# EasyEDA Pro project 8CH_ADC_CAPTURE_CARD.epro, schematic 8CH_ADC_CARD_V3.X

## Sheets
1 MCU: Create Date: 2025-01-20; Page Name: MCU; Project Name: 8CH_ADC_CAPTURE_CARD; Schematic Name: 8CH_ADC_CARD_V2.X; Update Date: 2025-01-22; Company: 嘉立创EDA; Page Size: A4; Version: V1.0
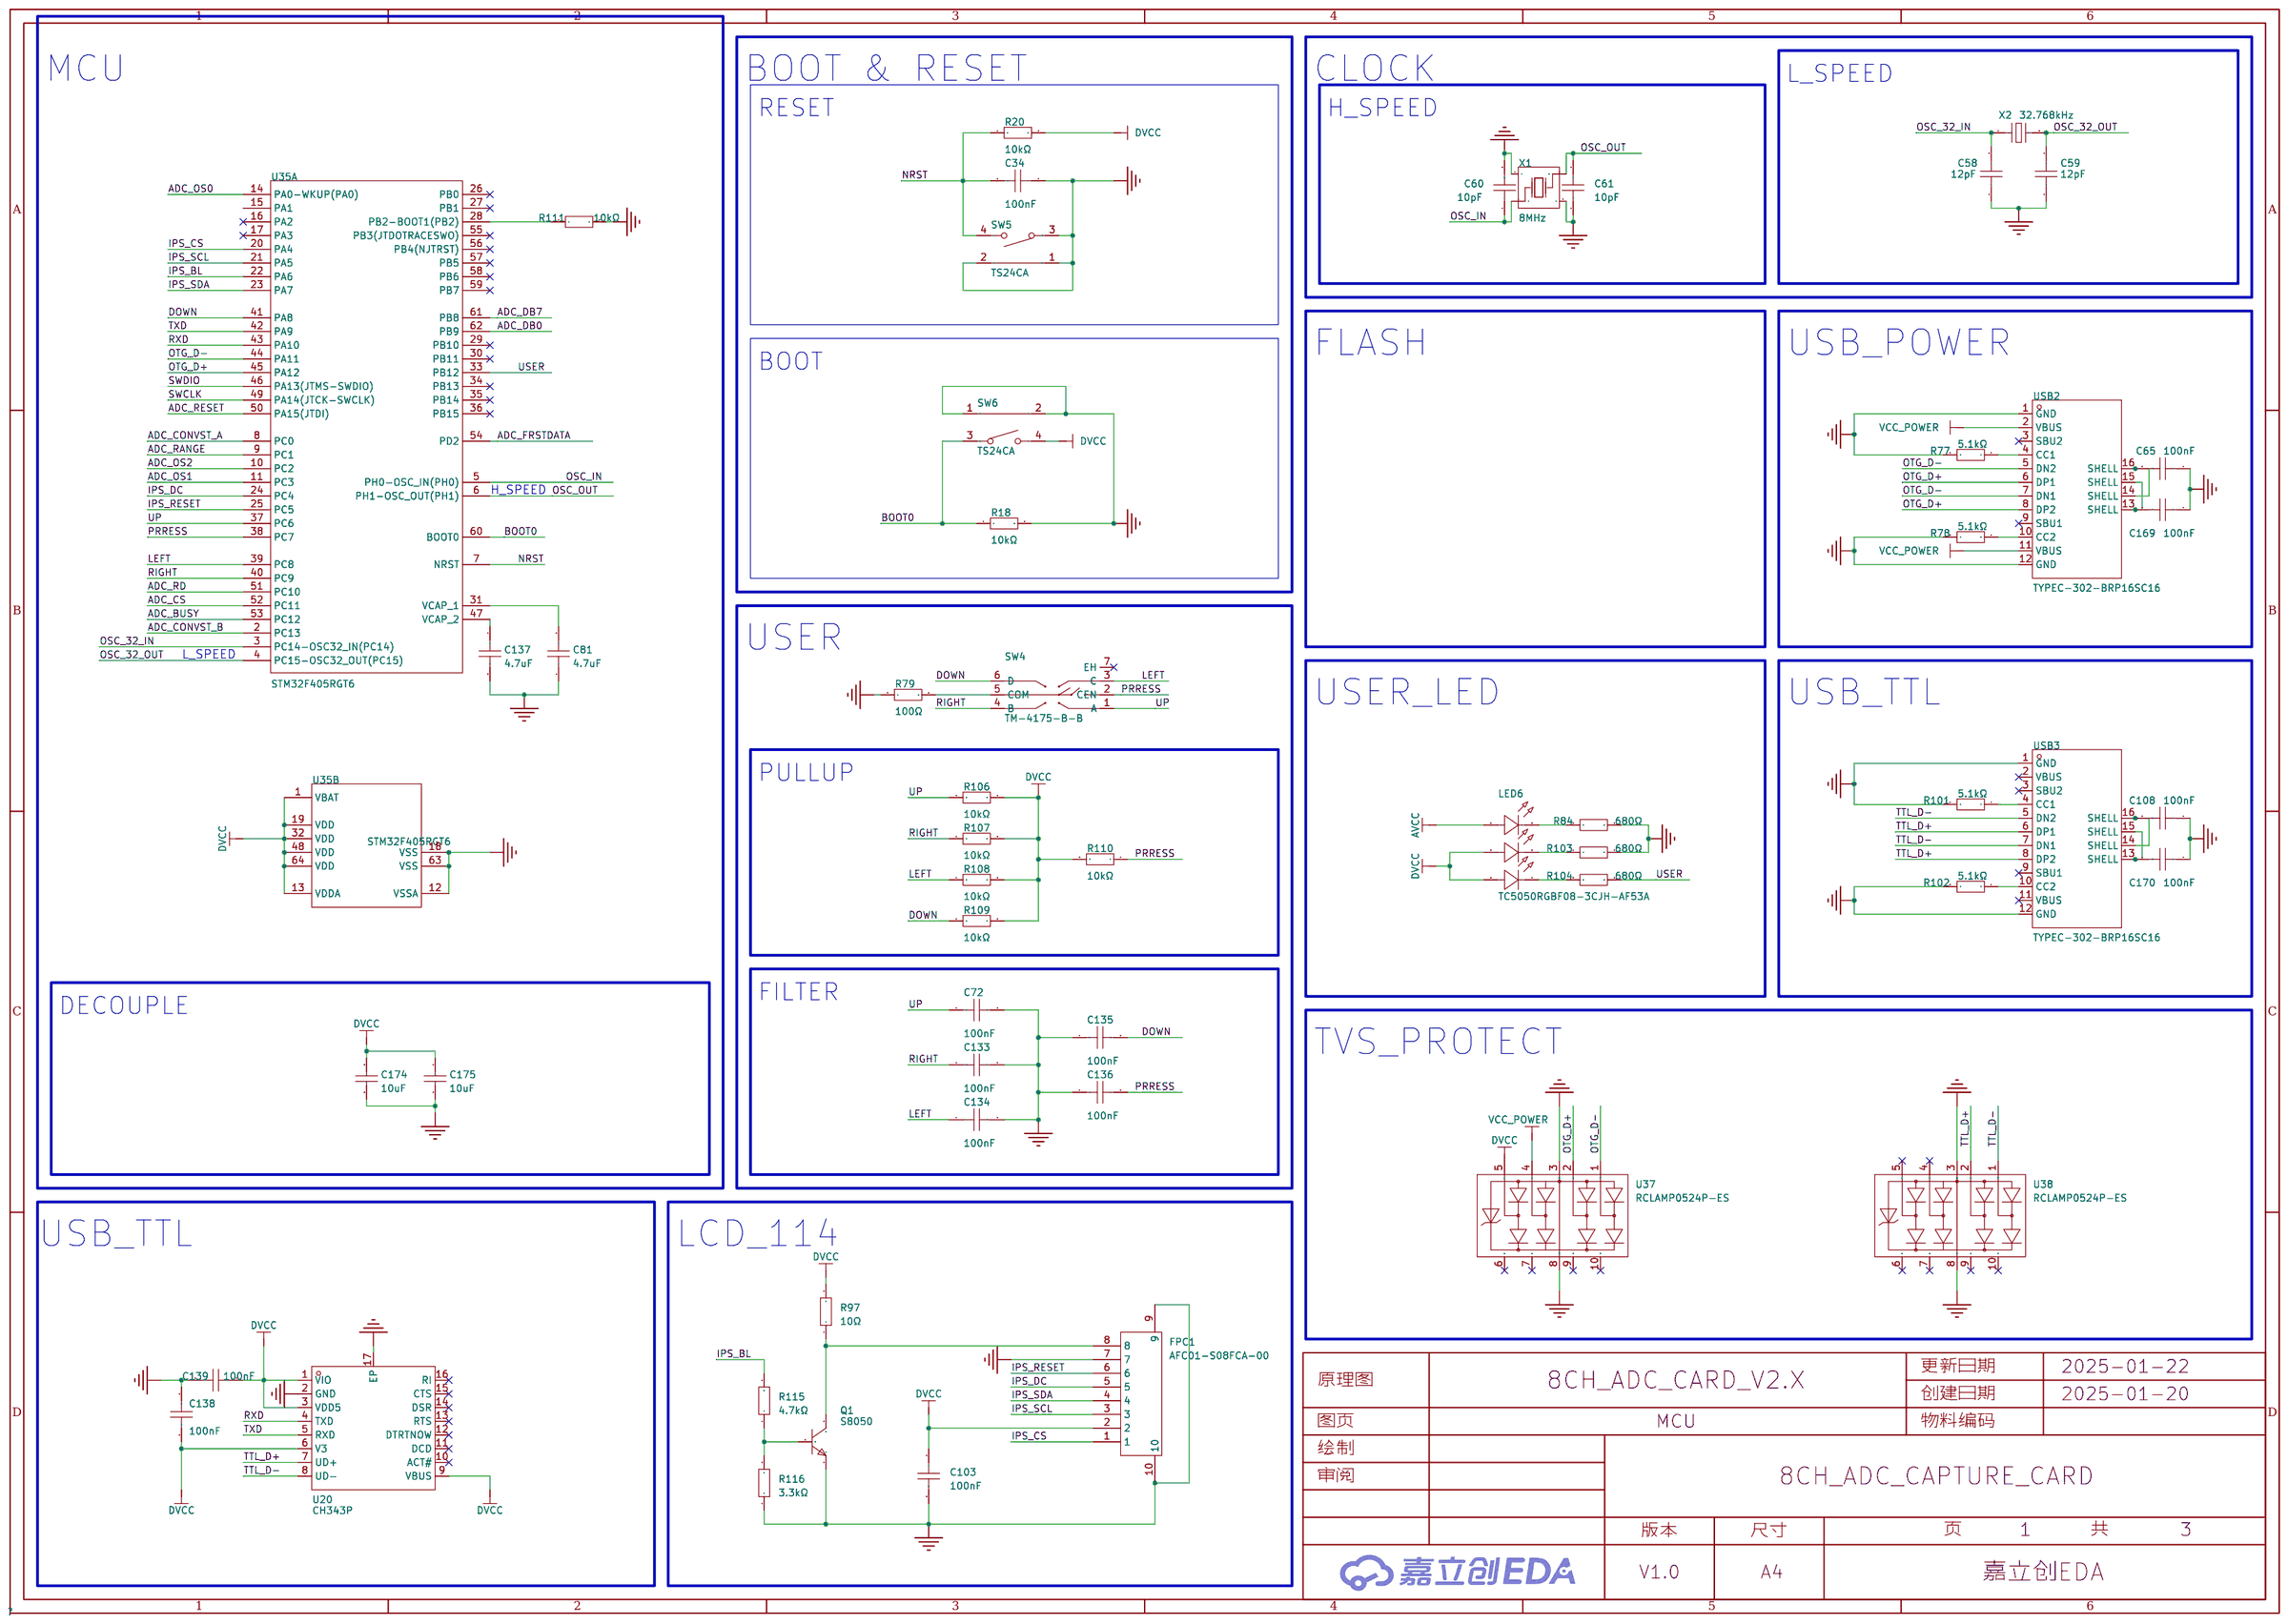
[diagram p6: MCU]
2 ADC: Page Name: ADC; Update Date: 2025-01-20
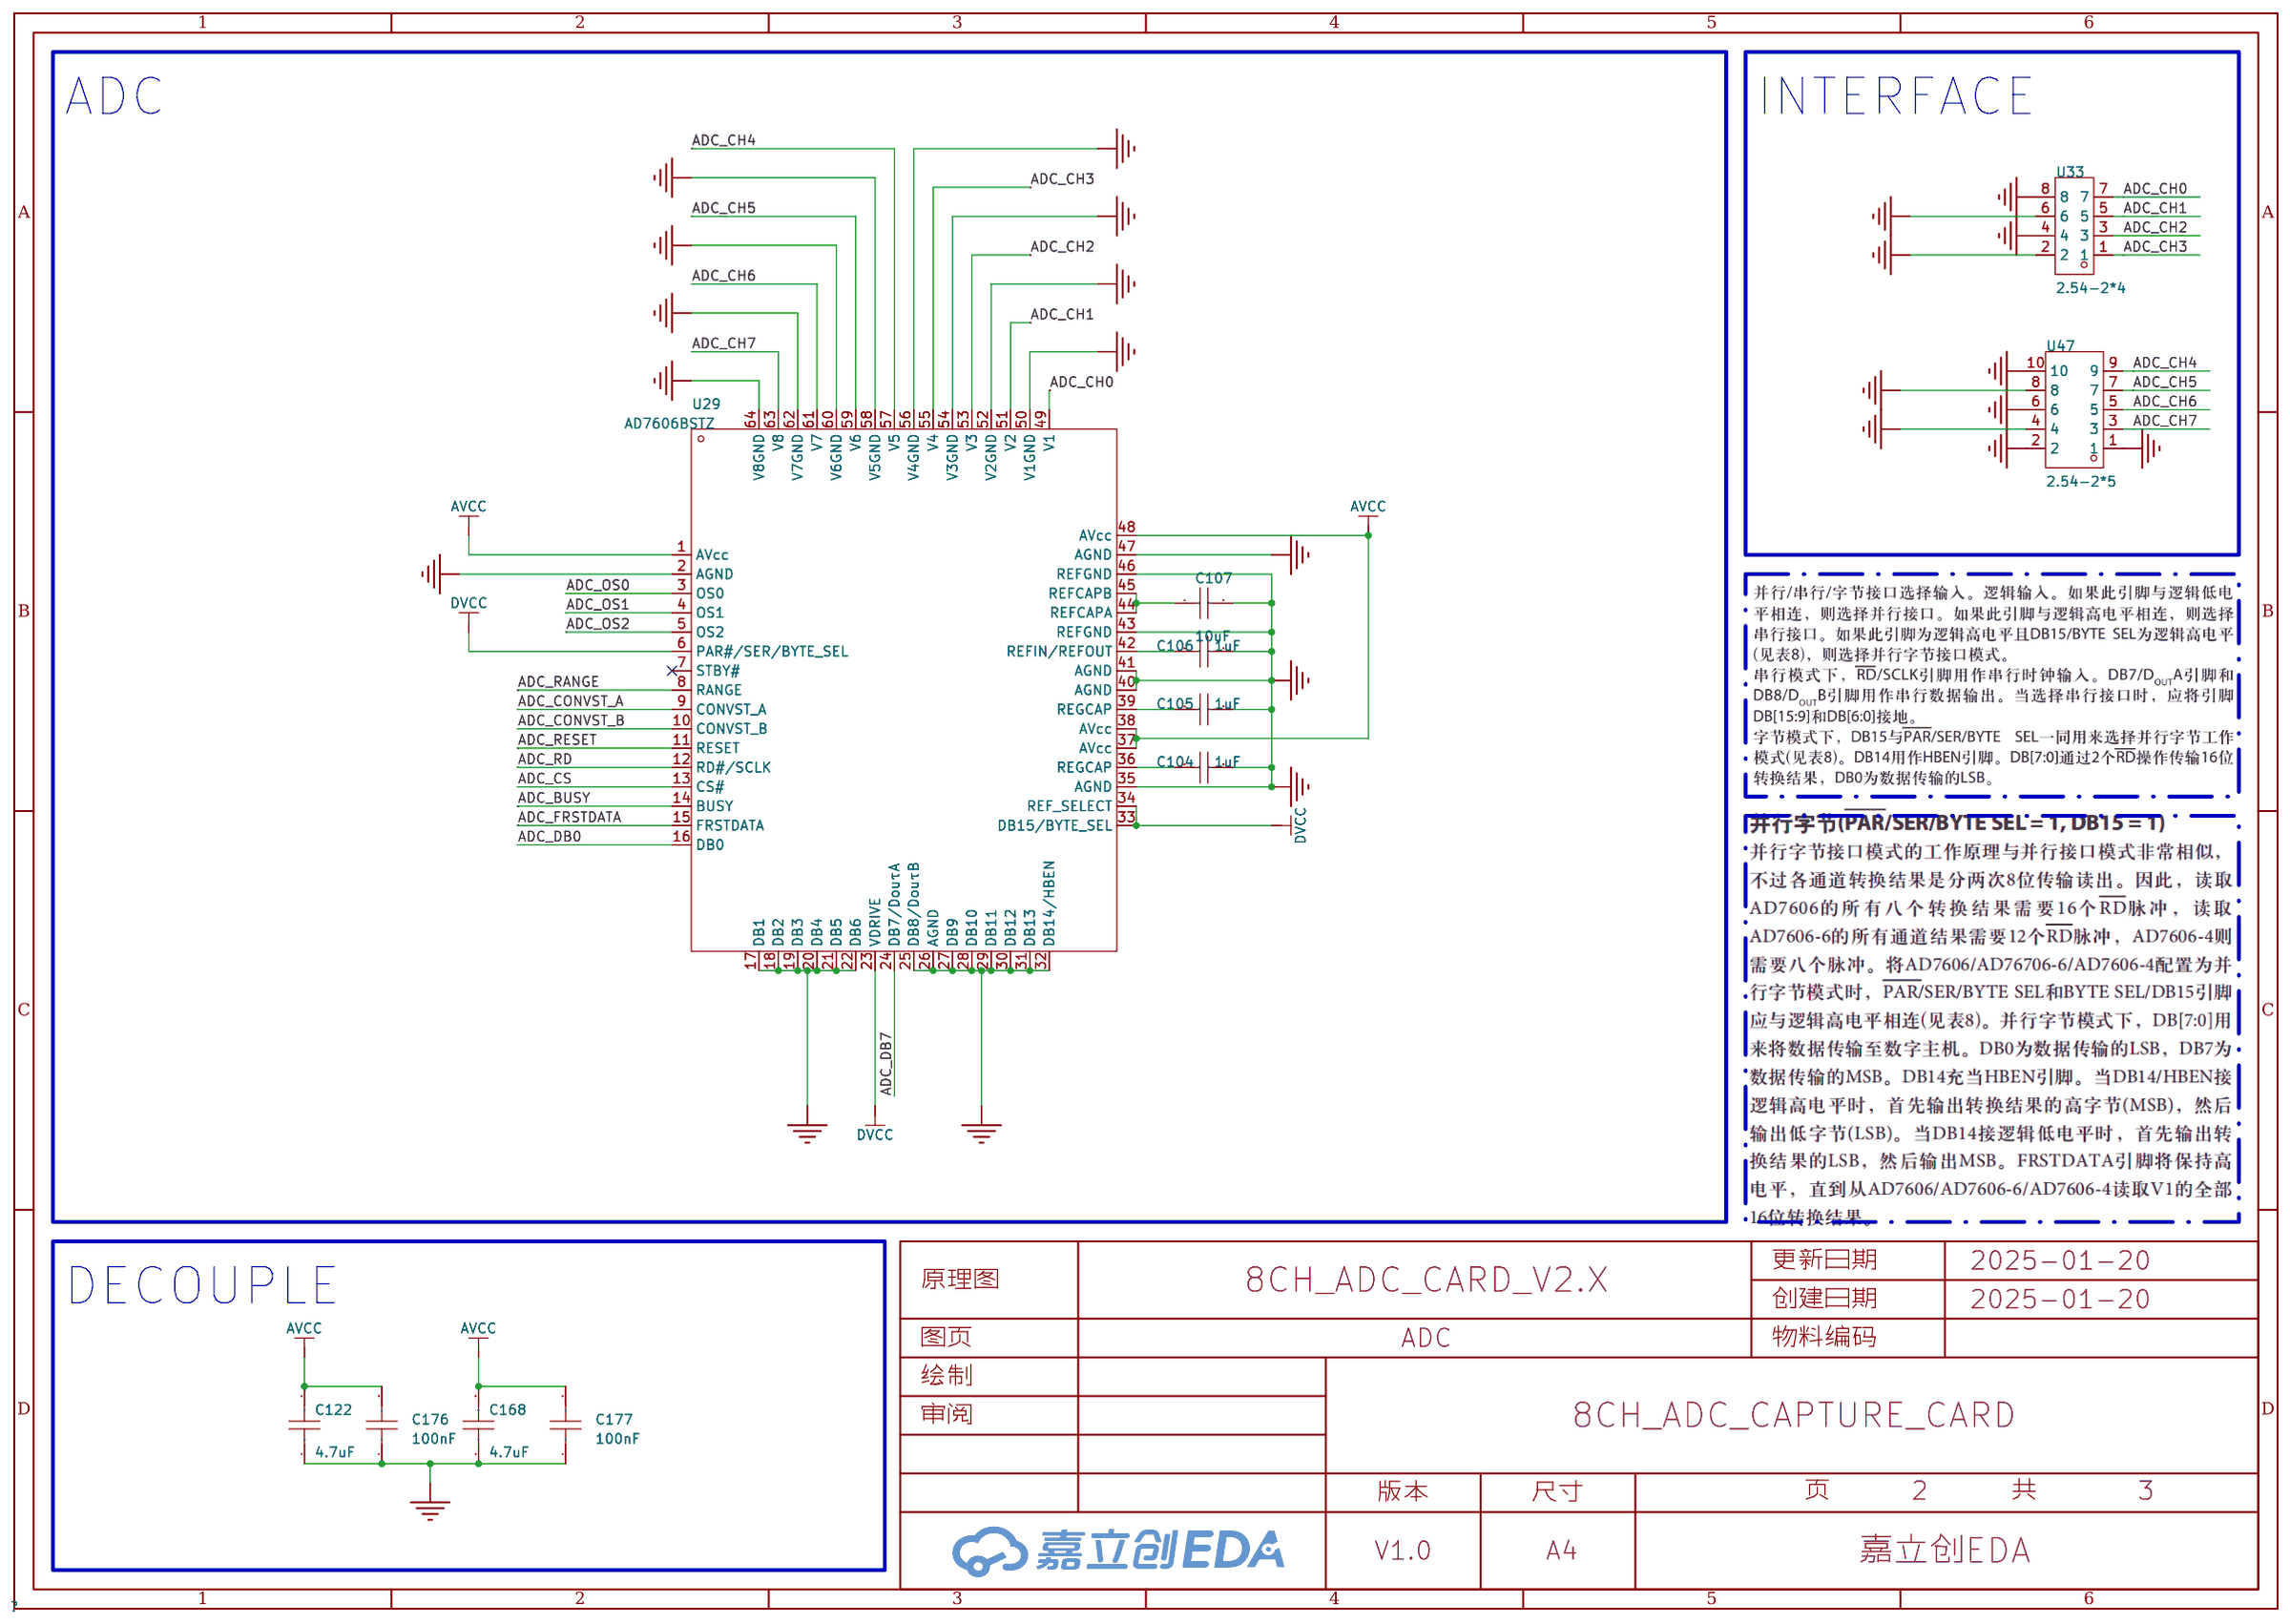
[diagram p7: ADC]
3 POWER: Page Name: POWER; Schematic Name: 8CH_ADC_CARD_V2.0; Update Date: 2025-01-20
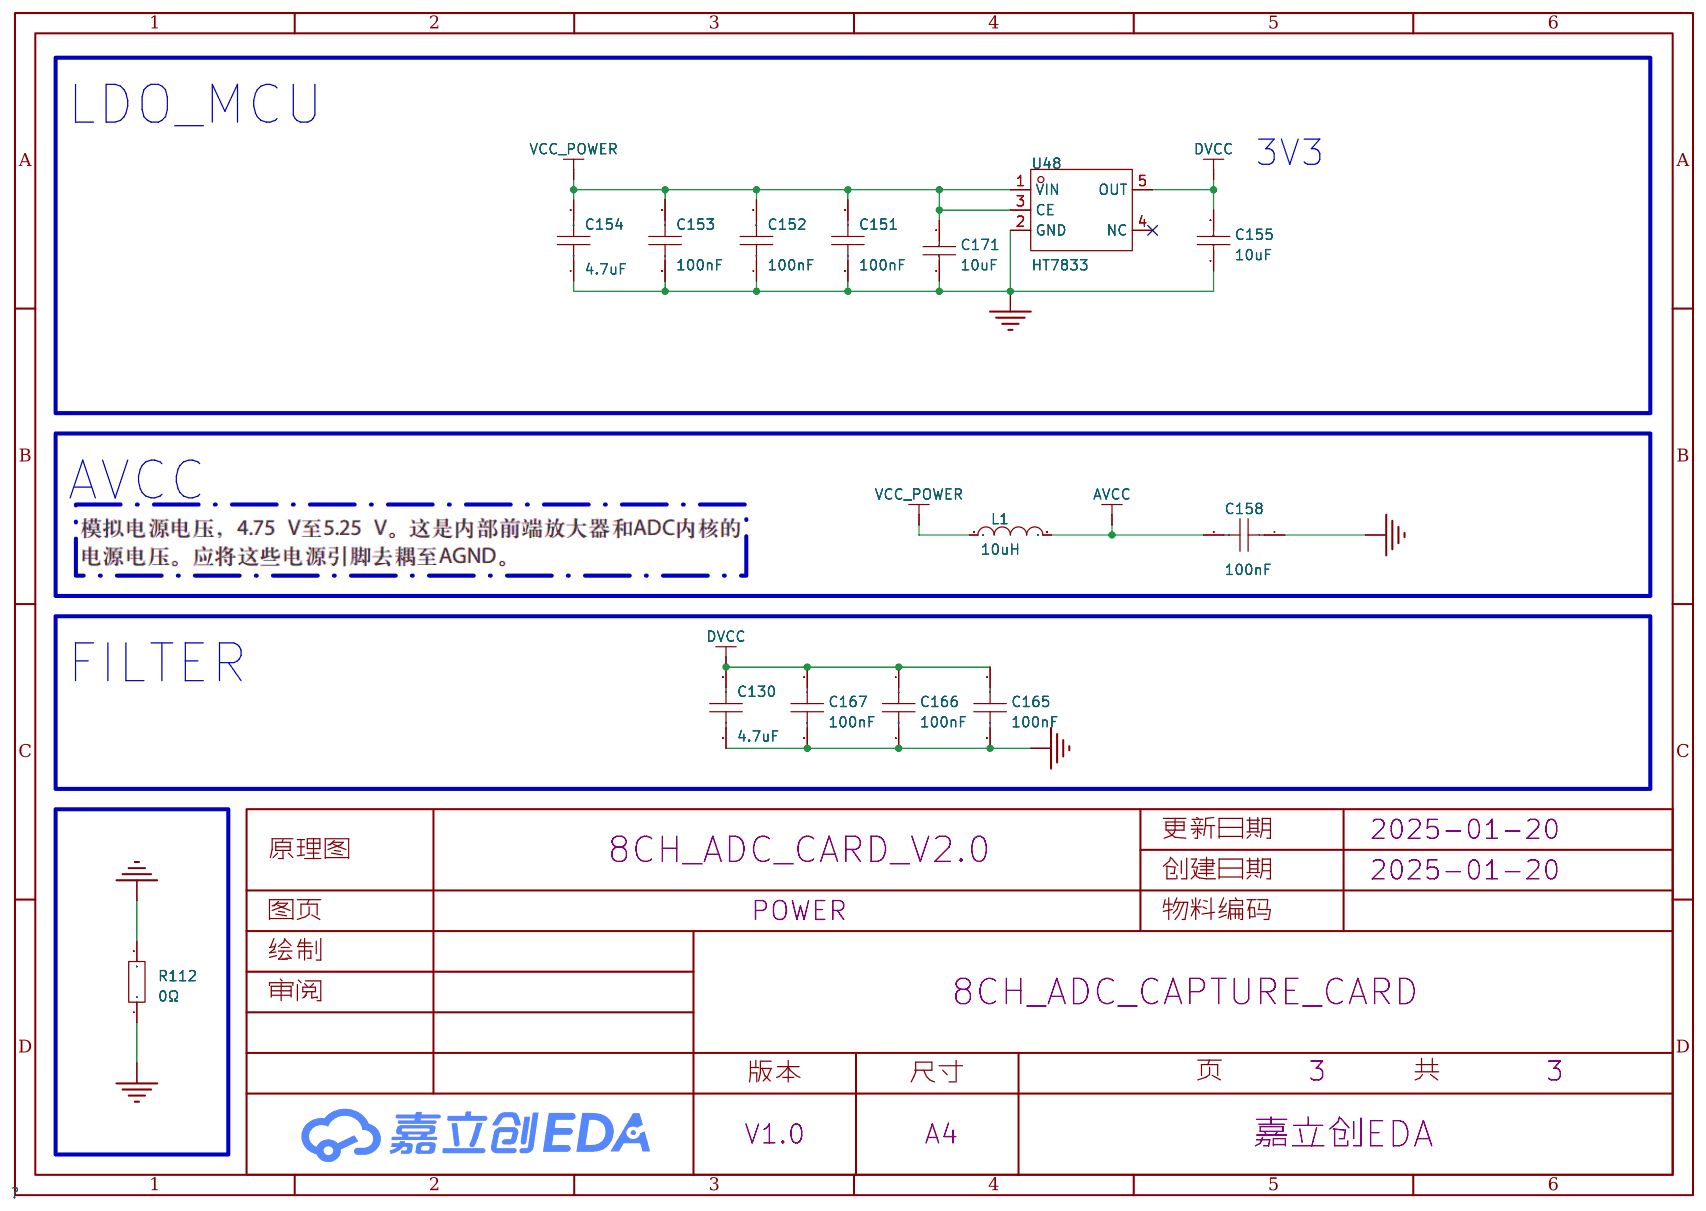
[diagram p8: POWER]

## Parts
sheet ADC
C104  1uF  [C0402]
C105  1uF  [C0402]
C106  1uF  [C0402]
C107  10uF  [C0402]
C122  4.7uF  [C0402]
C168  4.7uF  [C0402]
C176  100nF  [C0402]
C177  100nF  [C0402]
U29  AD7606BSTZ  [LQFP-64_L10.0-W10.0-P0.50-LS12.0-BL]
U33  2.54-2*4  [HDR-TH_8P-P2.54-V-F-R2-C4-S2.54]
U47  2.54-2*5  [HDR-TH_10P-P2.54-V-F-R2-C5-S2.54]
sheet MCU
C34  100nF  [C0402]
C58  12pF  [C0402]
C59  12pF  [C0402]
C60  10pF  [C0402]
C61  10pF  [C0402]
C65  100nF  [C0402]
C72  100nF  [C0402]
C81  4.7uF  [C0402]
C103  100nF  [C0402]
C108  100nF  [C0402]
C133  100nF  [C0402]
C134  100nF  [C0402]
C135  100nF  [C0402]
C136  100nF  [C0402]
C137  4.7uF  [C0402]
C138  100nF  [C0402]
C139  100nF  [C0402]
C169  100nF  [C0402]
C170  100nF  [C0402]
C174  10uF  [C0402]
C175  10uF  [C0402]
FPC1  AFC01-S08FCA-00  [FPC-SMD_P0.50-8P_FGS-XJ-H2.0]
LED6  TC5050RGBF08-3CJH-AF53A  [LED-SMD_6P-L5.0-W5.0-TL_TC5050RGBF08]
Q1  S8050  [SOT-23-3_L2.9-W1.3-P1.90-LS2.3-BR]
R18  10kΩ  [R0402]
R20  10kΩ  [R0402]
R77  5.1kΩ  [R0402]
R78  5.1kΩ  [R0402]
R79  100Ω  [R0402]
R84  680Ω  [R0402]
R97  10Ω  [R0402]
R101  5.1kΩ  [R0402]
R102  5.1kΩ  [R0402]
R103  680Ω  [R0402]
R104  680Ω  [R0402]
R106  10kΩ  [R0402]
R107  10kΩ  [R0402]
R108  10kΩ  [R0402]
R109  10kΩ  [R0402]
R110  10kΩ  [R0402]
R111  10kΩ  [R0402]
R115  4.7kΩ  [R0402]
R116  3.3kΩ  [R0402]
SW4  TM-4175-B-B  [SW-SMD_TM-4175-B-X]
SW5  TS24CA  [SW-SMD_TS24CA]
SW6  TS24CA  [SW-SMD_TS24CA]
U20  CH343P  [TQFN-16_L3.0-W3.0-P0.50-BL-EP1.7]
U35  STM32F405RGT6  [LQFP-64_L10.0-W10.0-P0.50-LS12.0-BL]  (sections 1,2)
U37  RCLAMP0524P-ES  [DFN2510-10_L2.5-W1.0-P0.50-BL]
U38  RCLAMP0524P-ES  [DFN2510-10_L2.5-W1.0-P0.50-BL]
USB2  TYPEC-302-BRP16SC16  [USB-C-SMD_TYPEC-302-BRP16SC16]
USB3  TYPEC-302-BRP16SC16  [USB-C-SMD_TYPEC-302-BRP16SC16]
X1  8MHz  [OSC-SMD_4P-L3.2-W2.5-BL]
X2  32.768kHz  [OSC-SMD_L3.2-W1.5]
sheet POWER
C130  4.7uF  [C0402]
C151  100nF  [C0402]
C152  100nF  [C0402]
C153  100nF  [C0402]
C154  4.7uF  [C0402]
C155  10uF  [C0402]
C158  100nF  [C0402]
C165  100nF  [C0402]
C166  100nF  [C0402]
C167  100nF  [C0402]
C171  10uF  [C0402]
L1  10uH  [IND-SMD_L2.5-W2.0]
R112  0Ω  [R0402]
U48  HT7833  [SOT-23-5_L2.9-W1.6-P0.95-LS2.8-BL]

## Library data of the parts
C104-C106 = CL05A105KP5NNNC: 容值:1uF;精度:±10%;额定电压:10V;材质(温度系数):X5R;; LCSC Part Name: 1uF ±10% 10V; Supplier Part: C14445; Manufacturer: SAMSUNG(三星); Supplier Footprint: 0402; JLCPCB Part Class: 扩展库; Datasheet: https://atta.szlcsc.com/upload/public/pdf/source/20160218/1457707763339.pdf; Supplier: LCSC; Tolerance: ±10%; Voltage Rated: 10V; Temperature Coefficient: X5R
C107 C155 C171 C174 C175 = CL05A106MQ5NUNC: 容值:10uF;精度:±20%;额定电压:6.3V;材质(温度系数):X5R;; LCSC Part Name: 10uF ±20% 6.3V; Supplier Part: C15525; Manufacturer: SAMSUNG(三星); Supplier Footprint: 0402; JLCPCB Part Class: 基础库; Datasheet: https://atta.szlcsc.com/upload/public/pdf/source/20220823/2B02EE04F8F211D38A52DCB16EB6BEBA.pdf; Supplier: LCSC; Tolerance: ±20%; Voltage Rated: 6.3V; Temperature Coefficient: X5R
C122 C130 C154 C168 = CL05A475KP5NRNC: 容值:4.7uF;精度:±10%;额定电压:10V;材质(温度系数):X5R;; LCSC Part Name: 4.7uF ±10% 10V; Supplier Part: C368809; Manufacturer: SAMSUNG(三星); Supplier Footprint: 0402; JLCPCB Part Class: 扩展库; Datasheet: https://atta.szlcsc.com/upload/public/pdf/source/20160218/1457707763339.pdf; Supplier: LCSC; Tolerance: ±10%; Voltage Rated: 10V; Temperature Coefficient: X5R
C65 C72 C108 C133-C136 C138 C139 C151-C153 C158 C165-C167 C169 C170 C176 C177 = GRM155R71H104KE14D: 容值:100nF;精度:±10%;额定电压:50V;材质(温度系数):X7R;; LCSC Part Name: 100nF ±10% 50V; Supplier Part: C77020; Manufacturer: muRata(村田); Supplier Footprint: 0402; JLCPCB Part Class: 扩展库; Datasheet: https://atta.szlcsc.com/upload/public/pdf/source/20180326/C77020_39BD49C951FF1AF0DB1F1FAC5AC1E401.pdf; Supplier: LCSC; Tolerance: ±10%; Voltage Rated: 50V; Temperature Coefficient: X7R
U29 = AD7606BSTZ: 分辨率(位):16;供电电压:2.3V~5.25V；4.75V~5.25V;; LCSC Part Name: 8 通道 DAS，支持 16 位、双极性输入、同步采样 ADC; Supplier Part: C398827; Manufacturer: ADI(亚德诺); Supplier Footprint: LQFP-64(10x10); JLCPCB Part Class: 扩展库; Datasheet: https://atta.szlcsc.com/upload/public/pdf/source/20200312/C495029_477E5B714CC8ADA3D7A4ECEA0C949302.pdf; Supplier: LCSC; Resolution: 16; Number of Channels: 8; Supply Voltage: 2.3V~5.25V；4.75V~5.25V; Operating Temperature: -40℃~+85℃
U33 = 2.54-2*4: 插孔结构:2x4P;间距:2.54mm;行距:2.54mm;圆孔/方孔:方孔;安装类型:直插;排数:双排;总孔位数:8P;额定电流:2.5A;额定电压:-;插孔方向:顶部;塑高:8.5mm;工作温度范围:-40℃~+105℃;; LCSC Part Name: 间距:2.54mm 2x4P 直插; Supplier Part: C2977588; Manufacturer: ZHOURI(洲日); Supplier Footprint: 插件,P=2.54mm; JLCPCB Part Class: 扩展库; Datasheet: https://atta.szlcsc.com/upload/public/pdf/source/20220328/363EB391BC0EB759CF231FC910753CBE.pdf; Supplier: LCSC; Holes Structure: 2x4P; Pitch: 2.54mm; Row Spacing: 2.54mm; Circular Hole / Square Hole: 方孔; Mounting Type: 直插; Number of Rows: 双排; Number of Holes: 8P; Current Rating (Max): 2.5A; Holes Direction: 顶部; Insulation Height: 8.5mm; Operating Temperature Range: -40℃~+105℃
U47 = 2.54-2*5: 插孔结构:2x5P;间距:2.54mm;行距:2.54mm;圆孔/方孔:方孔;安装类型:直插;排数:双排;总孔位数:10P;额定电流:2.5A;额定电压:-;插孔方向:顶部;塑高:8.5mm;工作温度范围:-40℃~+105℃;; LCSC Part Name: 间距:2.54mm 2x5P 直插; Supplier Part: C2977587; Manufacturer: ZHOURI(洲日); Supplier Footprint: 插件,P=2.54mm; JLCPCB Part Class: 扩展库; Datasheet: https://atta.szlcsc.com/upload/public/pdf/source/20220328/53961E697C4FF664B69BABFADEC8B830.pdf; Supplier: LCSC; Holes Structure: 2x5P; Pitch: 2.54mm; Row Spacing: 2.54mm; Circular Hole / Square Hole: 方孔; Mounting Type: 直插; Number of Rows: 双排; Number of Holes: 10P; Current Rating (Max): 2.5A; Holes Direction: 顶部; Insulation Height: 8.5mm; Operating Temperature Range: -40℃~+105℃
C34 C103 = CC0402JRX7R7BB104: 容值:100nF;精度:±5%;额定电压:16V;材质(温度系数):X7R;; LCSC Part Name: 100nF ±5% 16V; Supplier Part: C541464; Manufacturer: YAGEO(国巨); Supplier Footprint: 0402; JLCPCB Part Class: 扩展库; Datasheet: https://atta.szlcsc.com/upload/public/pdf/source/20200615/C541464_B57AABC9570B6B2CE091E735F96B12C0.pdf; Supplier: LCSC; Tolerance: ±5%; Voltage Rated: 16V; Temperature Coefficient: X7R
C58 C59 = GCM1555C1H120FA16D: 容值:12pF;精度:±1%;额定电压:50V;材质(温度系数):C0G;; LCSC Part Name: 12pF ±1% 50V; Supplier Part: C393682; Manufacturer: muRata(村田); Supplier Footprint: 0402; JLCPCB Part Class: 扩展库; Datasheet: https://atta.szlcsc.com/upload/public/pdf/source/20190516/C393682_2405B7553F1D74F0F214F12B2CF6E34B.pdf; Supplier: LCSC; Tolerance: ±1%; Voltage Rated: 50V; Temperature Coefficient: C0G
C60 C61 = CL05C100JB5NNNC: 容值:10pF;精度:±5%;额定电压:50V;材质(温度系数):C0G;; LCSC Part Name: 10pF ±5% 50V; Supplier Part: C32949; Manufacturer: SAMSUNG(三星); Supplier Footprint: 0402; JLCPCB Part Class: 基础库; Datasheet: https://atta.szlcsc.com/upload/public/pdf/source/20160218/1457707763339.pdf; Supplier: LCSC; Tolerance: ±5%; Voltage Rated: 50V; Temperature Coefficient: C0G
C81 C137 = CL05A475MQ5NRNC: 容值:4.7uF;精度:±20%;额定电压:6.3V;材质(温度系数):X5R;; LCSC Part Name: 4.7uF ±20% 6.3V; Supplier Part: C307423; Manufacturer: SAMSUNG(三星); Supplier Footprint: 0402; JLCPCB Part Class: 扩展库; Datasheet: https://atta.szlcsc.com/upload/public/pdf/source/20181010/C307423_0E0C4E35F3A09F81C2E5C84E00499E42.pdf; Supplier: LCSC; Tolerance: ±20%; Voltage Rated: 6.3V; Temperature Coefficient: X5R
FPC1 = AFC01-S08FCA-00: 锁定特性:翻盖式;触点类型:下接;触点数量:8P;间距:0.5mm;安装类型:卧贴;; LCSC Part Name: 间距:0.5mm P数:8P 翻盖式 下接; Supplier Part: C262657; Manufacturer: JS(钜硕电子); Supplier Footprint: SMD,P=0.5mm,卧贴; JLCPCB Part Class: 扩展库; Datasheet: https://atta.szlcsc.com/upload/public/pdf/source/20190816/C413942_2A72D1AC756EAE17EEDF756A339D4500.pdf; Supplier: LCSC; Locking Feature: 翻盖式; Contact Type: 下接; Number of Contacts: 8P; Pitch: 0.5mm; Mounting Type: 卧贴; FFC, FCB Thickness: 0.3mm; Height Above Board: 2mm
LED6 = TC5050RGBF08-3CJH-AF53A: LED贴片5050RGB灯珠高亮红绿蓝三色0.2W; LCSC Part Name: RGB三色; Supplier Part: C784540; Manufacturer: TCWIN(天成); Supplier Footprint: SMD5050; JLCPCB Part Class: 扩展库; Datasheet: https://atta.szlcsc.com/upload/public/pdf/source/20230731/34B1F7048EB892D234C2083EEE9FB085.pdf; Supplier: LCSC; Operating Temperature: -40℃~+85℃
Q1 = S8050_C20069125: 晶体管类型:NPN;集电极电流(Ic):500mA;集射极击穿电压(Vceo):25V;功率(Pd):300mW;直流电流增益(hFE@Ic,Vce):120@50mA,1.0V;; LCSC Part Name: hFE:200-350，丝印:J3Y; Supplier Part: C20069125; Manufacturer: 宏迦橙; Supplier Footprint: SOT-23; JLCPCB Part Class: 扩展库; Datasheet: https://atta.szlcsc.com/upload/public/pdf/source/20240403/2D78449C96B6E27F13BF8BDF79E27159.pdf; Supplier: LCSC; Transistor Type: NPN; Collector Current (Ic): 500mA; Collector-Emitter Breakdown Voltage (Vceo): 25V; Power Dissipation (Pd): 300mW; DC Current Gain (hFE@Ic,Vce): 120@50mA,1.0V; Transition Frequency (fT): 100MHz; Collector Cut-Off Current (Icbo): 100nA; Collector-Emitter Saturation Voltage (VCE(sat)@Ic,Ib): 600mV@500mA,50mA; Operating Temperature: -55℃~+150℃
R18 R20 R106-R110 = RC0402FR-0710KL: 电阻类型:厚膜电阻;阻值:10kΩ;精度:±1%;功率:62.5mW;; LCSC Part Name: 10kΩ ±1% 62.5mW; Supplier Part: C60490; Manufacturer: YAGEO(国巨); Supplier Footprint: 0402; JLCPCB Part Class: 扩展库; Datasheet: https://atta.szlcsc.com/upload/public/pdf/source/20170606/1496716515432.pdf; Supplier: LCSC; Type: 厚膜电阻; Tolerance: ±1%; Power(Watts): 62.5mW; Overload Voltage (Max): 50V; Temperature Coefficient: ±100ppm/℃; Operating Temperature Range: -55℃~+155℃
R77 R78 R101 R102 = 0402WGF5101TCE: 电阻类型:厚膜电阻;阻值:5.1kΩ;精度:±1%;功率:62.5mW;最大工作电压:50V;温度系数:±100ppm/℃;; LCSC Part Name: 5.1kΩ ±1% 62.5mW 厚膜电阻; Supplier Part: C25905; Manufacturer: UNI-ROYAL(厚声); Supplier Footprint: 0402; JLCPCB Part Class: 基础库; Datasheet: https://atta.szlcsc.com/upload/public/pdf/source/20200306/C422600_1E6D84923E4A46A82E41ADD87F860B5C.pdf; Supplier: LCSC; Type: 厚膜电阻; Tolerance: ±1%; Power(Watts): 62.5mW; Overload Voltage (Max): 50V; Temperature Coefficient: ±100ppm/℃; Operating Temperature Range: -55℃~+155℃
R79 = 0402WGJ0101TCE: 电阻类型:厚膜电阻;阻值:100Ω;精度:±5%;功率:62.5mW;最大工作电压:50V;温度系数:±100ppm/℃;; LCSC Part Name: 100Ω ±5% 62.5mW 厚膜电阻; Supplier Part: C25138; Manufacturer: UNI-ROYAL(厚声); Supplier Footprint: 0402; JLCPCB Part Class: 扩展库; Datasheet: https://atta.szlcsc.com/upload/public/pdf/source/20200306/C422600_1E6D84923E4A46A82E41ADD87F860B5C.pdf; Supplier: LCSC; Type: 厚膜电阻; Tolerance: ±5%; Power(Watts): 62.5mW; Overload Voltage (Max): 50V; Temperature Coefficient: ±100ppm/℃; Operating Temperature Range: -55℃~+155℃
R84 R103 R104 = 0402WGF6800TCE: 电阻类型:厚膜电阻;阻值:680Ω;精度:±1%;功率:62.5mW;最大工作电压:50V;温度系数:±100ppm/℃;; LCSC Part Name: 680Ω ±1% 62.5mW 厚膜电阻; Supplier Part: C25130; Manufacturer: UNI-ROYAL(厚声); Supplier Footprint: 0402; JLCPCB Part Class: 扩展库; Datasheet: https://atta.szlcsc.com/upload/public/pdf/source/20200306/C422600_1E6D84923E4A46A82E41ADD87F860B5C.pdf; Supplier: LCSC; Type: 厚膜电阻; Tolerance: ±1%; Power(Watts): 62.5mW; Overload Voltage (Max): 50V; Temperature Coefficient: ±100ppm/℃; Operating Temperature Range: -55℃~+155℃
R97 = 0402WGF100JTCE: 电阻类型:厚膜电阻;阻值:10Ω;精度:±1%;功率:62.5mW;最大工作电压:50V;温度系数:±200ppm/℃;; LCSC Part Name: 10Ω ±1% 62.5mW 厚膜电阻; Supplier Part: C25077; Manufacturer: UNI-ROYAL(厚声); Supplier Footprint: 0402; JLCPCB Part Class: 基础库; Datasheet: https://atta.szlcsc.com/upload/public/pdf/source/20200306/C422600_1E6D84923E4A46A82E41ADD87F860B5C.pdf; Supplier: LCSC; Type: 厚膜电阻; Tolerance: ±1%; Power(Watts): 62.5mW; Overload Voltage (Max): 50V; Temperature Coefficient: ±200ppm/℃; Operating Temperature Range: -55℃~+155℃
R111 = RC0402FR-0710KL: 电阻类型:厚膜电阻;阻值:10kΩ;精度:±1%;功率:62.5mW;最大工作电压:50V;温度系数:±100ppm/℃;; LCSC Part Name: 厚膜电阻 10kΩ ±1% 62.5mW; Supplier Part: C60490; Manufacturer: YAGEO(国巨); Supplier Footprint: 0402; JLCPCB Part Class: 扩展库; Datasheet: https://atta.szlcsc.com/upload/public/pdf/source/20170925/C131467_1506321478108990263.pdf; Supplier: LCSC; Type: 厚膜电阻; Tolerance: ±1%; Power(Watts): 62.5mW; Overload Voltage (Max): 50V; Temperature Coefficient: ±100ppm/℃; Operating Temperature Range: -55℃~+155℃
R115 = 0402WGF4701TCE: 电阻类型:厚膜电阻;阻值:4.7kΩ;精度:±1%;功率:62.5mW;最大工作电压:50V;温度系数:±100ppm/℃;; LCSC Part Name: 4.7kΩ ±1% 62.5mW 厚膜电阻; Supplier Part: C25900; Manufacturer: UNI-ROYAL(厚声); Supplier Footprint: 0402; JLCPCB Part Class: 基础库; Datasheet: https://atta.szlcsc.com/upload/public/pdf/source/20200306/C422600_1E6D84923E4A46A82E41ADD87F860B5C.pdf; Supplier: LCSC; Type: 厚膜电阻; Tolerance: ±1%; Power(Watts): 62.5mW; Overload Voltage (Max): 50V; Temperature Coefficient: ±100ppm/℃; Operating Temperature Range: -55℃~+155℃
R116 = 0402WGF3301TCE: 电阻类型:厚膜电阻;阻值:3.3kΩ;精度:±1%;功率:62.5mW;最大工作电压:50V;温度系数:±100ppm/℃;; LCSC Part Name: 3.3kΩ ±1% 62.5mW 厚膜电阻; Supplier Part: C25890; Manufacturer: UNI-ROYAL(厚声); Supplier Footprint: 0402; JLCPCB Part Class: 基础库; Datasheet: https://atta.szlcsc.com/upload/public/pdf/source/20200306/C422600_1E6D84923E4A46A82E41ADD87F860B5C.pdf; Supplier: LCSC; Type: 厚膜电阻; Tolerance: ±1%; Power(Watts): 62.5mW; Overload Voltage (Max): 50V; Temperature Coefficient: ±100ppm/℃; Operating Temperature Range: -55℃~+155℃
SW4 = TM-4175-B-B: LCSC Part Name: 7.5*7.5*6五向开关 H6 升级减少摇晃 显示器五向开关; Supplier Part: C465996; Manufacturer: XKB Connection(中国星坤); Supplier Footprint: SMD-8P,7.5x7.5mm; JLCPCB Part Class: 扩展库; Datasheet: https://atta.szlcsc.com/upload/public/pdf/source/20211011/A0F6117F2AB0E02F6CF3847B7456F266.pdf; Supplier: LCSC
SW5 SW6 = TS24CA: 电路结构:单刀单掷;按钮形状:矩形按钮;安装方式:卧贴;开关长度:4.55mm;开关宽度:1.8mm;开关高度:3.5mm;触点电流:50mA;额定电压(DC):12V;带灯:-;机械寿命:-;; LCSC Part Name: 4.55*1.8*3.5mm 卧贴 轻触开关; Supplier Part: C393942; Manufacturer: SHOU HAN(首韩); Supplier Footprint: SMD; JLCPCB Part Class: 扩展库; Datasheet: https://atta.szlcsc.com/upload/public/pdf/source/20190521/C393942_591A9E318887EFA4274D34029981AD99.pdf; Supplier: LCSC; Circuit: 单刀单掷; Actuator Style: 矩形按钮; Mounting Style: 卧贴; Switch Length: 4.55mm; Switch Width: 1.8mm; Switch Height: 3.5mm; Contact Current: 50mA; Voltage Rating (DC): 12V
U20 = CH343P: 应用功能:-;接口协议:-;; Supplier Part: C2846043; Manufacturer: WCH(南京沁恒); Supplier Footprint: TQFN-16-EP(3x3); JLCPCB Part Class: 扩展库; Datasheet: https://atta.szlcsc.com/upload/public/pdf/source/20211010/C2846043_7FA705E1F14A2906F6A2AFA45FA28209.pdf; Supplier: LCSC
U35 = STM32F405RGT6: CPU内核:ARM-M4;CPU最大主频:168MHz;应用领域:-;; LCSC Part Name: 带DSP和FPU的高性能基础系列ARM Cortex-M4 MCU，具有1 MB Flash、168 MHz CPU和ART加速器; Supplier Part: C15742; Manufacturer: ST(意法半导体); Supplier Footprint: LQFP-64(10x10); JLCPCB Part Class: 扩展库; Datasheet: https://atta.szlcsc.com/upload/public/pdf/source/20140801/1457707197138.pdf; Supplier: LCSC; CPU Core: ARM-M4; CPU Maximum Speed: 168MHz; Program Storage Size: 1MB; Program Memory Type: FLASH; Number of I/O: 51; ADC (Bit): 12bit; DAC (Bit): 12bit; Low Voltage Detection Threshold: 1.8V~3.6V
U37 U38 = RCLAMP0524P-ES: 极性:单向;反向截止电压(Vrwm):5V;最大钳位电压:12V;峰值脉冲电流(Ipp):4.5A;峰值脉冲功率(Ppp):60W;击穿电压:6V;; LCSC Part Name: 0524P，4路单向ESD静电防护器件，20kV，CJ：0.6pF；HDMI/USB高速接口通讯防护; Supplier Part: C5180236; Manufacturer: ElecSuper(静芯微); Supplier Footprint: DFN2510-10L; JLCPCB Part Class: 扩展库; Datasheet: https://atta.szlcsc.com/upload/public/pdf/source/20240905/F7E709DD0DC794A5B81F30510399CED3.pdf; Supplier: LCSC; polarity: 单向; Reverse Stand-Off Voltage (Vrwm): 5V; Maximum Clamping Voltage: 12V; Peak Pulse Current (Ipp): 4.5A; Peak Pulse Power Dissipation (Ppp): 60W; Breakdown Voltage: 6V; Reverse Leakage Current (Ir): 1uA; Number of Lines: 四路; Type: ESD
USB2 USB3 = TYPEC-302-BRP16SC16: 连接器类型:Type-C;标准:USB 3.1;公母:母;端口数量:1;触点数量:16P;安装方式:沉板;额定电流 - 电源:5A;工作温度范围:-45℃~+85℃;焊接温度(最大值):260℃;; LCSC Part Name: Type-C 母 沉板; Supplier Part: C2835313; Manufacturer: XUNPU(讯普); Supplier Footprint: SMD; JLCPCB Part Class: 扩展库; Datasheet: https://atta.szlcsc.com/upload/public/pdf/source/20210629/C2835313_96CAAD9C15DFF4F1D03DDC0B4E6AD92A.pdf; Supplier: LCSC; Connector Type: Type-C; Standard: USB 3.1; Gender: 母; Number of Ports: 1; Number of Contacts: 16P; Mounting Style: 沉板; Current Rating - Power (Max): 5A; Operating Temperature Range: -45℃~+85℃; Soldering Temperature(Max): 260℃
X1 = TAXM8M4RDBCCT2T: 晶振类型:贴片晶振;频率:8MHz;常温频差:±10ppm;外接负载电容:10pF;频率稳定度(全温):±15ppm;; LCSC Part Name: 8MHz ±10ppm 10pF; Supplier Part: C400090; Manufacturer: YJX(雅晶鑫); Supplier Footprint: SMD3225-4P; JLCPCB Part Class: 扩展库; Datasheet: https://atta.szlcsc.com/upload/public/pdf/source/20190626/C400090_CF95B89E745AFE4EF2E392EF8AC009D6.pdf; Supplier: LCSC; Crystal Type: 贴片晶振; Normal temperature Frequency Tolerance: ±10ppm; External load capacitor: 10pF; Frequency Stability(Full temperature range): ±15ppm; Equivalent Series Resistance (ESR): 250Ω; Operating Temperature: -40℃~+85℃
X2 = X321532768KGD2SI: 晶振类型:贴片晶振;频率:32.768kHz;常温频差:±20ppm;外接负载电容:12.5pF;频率稳定度(全温):-;; LCSC Part Name: 32.768kHz ±20ppm 12.5pF; Supplier Part: C620155; Manufacturer: YXC(扬兴晶振); Supplier Footprint: SMD3215-2P; JLCPCB Part Class: 扩展库; Datasheet: https://atta.szlcsc.com/upload/public/pdf/source/20240329/3A7650FD985DD0DE85694D3785AB4916.pdf; Supplier: LCSC; Crystal Type: 贴片晶振; Normal temperature Frequency Tolerance: ±20ppm; External load capacitor: 12.5pF; Operating Temperature: -40℃~+85℃
L1 = FTC252012S100MBCA: 电感值:10uH;精度:±20%;额定电流:1.2A;饱和电流(Isat):1.6A;类型:一体成型电感;; LCSC Part Name: 10uH ±20% 1.6A; Supplier Part: C5832376; Manufacturer: cjiang(长江微电); Supplier Footprint: SMD,2x2.5mm; JLCPCB Part Class: 扩展库; Datasheet: https://atta.szlcsc.com/upload/public/pdf/source/20230602/8FFEDA9C0247A92A0D4B67554BFE4091.pdf; Supplier: LCSC; Tolerance: ±20%; Rated Current: 1.2A; Saturation Current (Isat): 1.6A; DC Resistance (DCR): 330mΩ; Type: 一体成型电感
R112 = 0402WGF0000TCE: 电阻类型:厚膜电阻;阻值:0Ω;精度:±1%;功率:62.5mW;最大工作电压:50V;温度系数:±800ppm/℃;; LCSC Part Name: 0Ω ±1% 62.5mW 厚膜电阻; Supplier Part: C17168; Manufacturer: UNI-ROYAL(厚声); Supplier Footprint: 0402; JLCPCB Part Class: 基础库; Datasheet: https://atta.szlcsc.com/upload/public/pdf/source/20200306/C422600_1E6D84923E4A46A82E41ADD87F860B5C.pdf; Supplier: LCSC; Type: 厚膜电阻; Tolerance: ±1%; Power(Watts): 62.5mW; Overload Voltage (Max): 50V; Temperature Coefficient: ±800ppm/℃; Operating Temperature Range: -55℃~+155℃
U48 = HT7833_C3011187: LCSC Part Name: 500mA 2uA Hight PSRR Voltage Regulator; Supplier Part: C3011187; Manufacturer: TECH PUBLIC(台舟); Supplier Footprint: SOT-23-5; JLCPCB Part Class: 扩展库; Datasheet: https://atta.szlcsc.com/upload/public/pdf/source/20220511/52D8A72EC3CBC44D368221752E30E118.pdf; Supplier: LCSC

## Nets
AGND: C104.2 C105.2 C106.2 C107.2 C122.1 C158.1 C168.1 C176.1 C177.1 R112.1 U29.2(AGND) U29.17(DB1) U29.18(DB2) U29.19(DB3) U29.20(DB4) U29.21(DB5) U29.22(DB6) U29.25(DB8/DouτB) U29.26(AGND) U29.27(DB9) U29.28(DB10) U29.29(DB11) U29.30(DB12) U29.31(DB13) U29.32(DB14/HBEN) U29.35(AGND) U29.40(AGND) U29.41(AGND) U29.43(REFGND) U29.46(REFGND) U29.47(AGND) U47.1 U47.2
AGND_CH0: U29.50(V1GND) U33.8
AGND_CH1: U29.52(V2GND) U33.6
AGND_CH2: U29.54(V3GND) U33.4
AGND_CH3: U29.56(V4GND) U33.2
AGND_CH4: U29.58(V5GND) U47.10
AGND_CH5: U29.60(V6GND) U47.8
AGND_CH6: U29.62(V7GND) U47.6
AGND_CH7: U29.64(V8GND) U47.4
AVCC: C122.2 C158.2 C168.2 C176.2 C177.2 L1.1 LED6.1(+) U29.1(AVcc) U29.37(AVcc) U29.38(AVcc) U29.48(AVcc)
DGND: C34.1 C58.1 C59.1 C60.2 C61.1 C65.1 C72.2 C81.1 C103.2 C108.1 C130.1 C133.2 C134.2 C135.1 C136.1 C137.2 C138.2 C139.2 C151.1 C152.1 C153.1 C154.1 C155.1 C165.2 C166.2 C167.2 C169.1 C170.1 C171.1 C174.1 C175.1 FPC1.7 FPC1.9 FPC1.10 Q1.2(E) R18.2 R77.2 R78.2 R79.1 R84.2 R101.2 R102.2 R103.2 R111.2 R112.2 R116.1 SW5.1 SW5.2 SW5.3 SW6.1 SW6.2 U20.2(GND) U20.17(EP) U35.12(VSSA) U35.18(VSS) U35.63(VSS) U37.3(GND) U37.8(GND) U38.3(GND) U38.8(GND) U48.2(GND) USB2.1(GND) USB2.12(GND) USB3.1(GND) USB3.12(GND) X1.2 X1.4
DVCC: C103.1 C130.2 C138.1 C139.1 C155.2 C165.1 C166.1 C167.1 C174.2 C175.2 FPC1.2 LED6.2(+) LED6.3(+) R20.2 R97.2 R106.2 R107.2 R108.2 R109.2 R110.2 SW6.4 U20.1(VIO) U20.3(VDD5) U20.6(V3) U20.9(VBUS) U29.6(PAR#/SER/BYTE_SEL) U29.23(VDRIVE) U29.33(DB15/BYTE_SEL) U29.34(REF_SELECT) U35.1(VBAT) U35.13(VDDA) U35.19(VDD) U35.32(VDD) U35.48(VDD) U35.64(VDD) U37.5(IO) U48.5(OUT)
VCC_POWER: C151.2 C152.2 C153.2 C154.2 C171.2 L1.2 U37.4(IO) U48.1(VIN) U48.3(CE) USB2.2(VBUS) USB2.11(VBUS)
ADC_BUSY: U29.14(BUSY) U35.53(PC12)
ADC_CH0: U29.49(V1) U33.7
ADC_CH1: U29.51(V2) U33.5
ADC_CH2: U29.53(V3) U33.3
ADC_CH3: U29.55(V4) U33.1
ADC_CH4: U29.57(V5) U47.9
ADC_CH5: U29.59(V6) U47.7
ADC_CH6: U29.61(V7) U47.5
ADC_CH7: U29.63(V8) U47.3
ADC_CONVST_A: U29.9(CONVST_A) U35.8(PC0)
ADC_CONVST_B: U29.10(CONVST_B) U35.2(PC13)
ADC_CS: U29.13(CS#) U35.52(PC11)
ADC_DB0: U29.16(DB0) U35.62(PB9)
ADC_DB7: U29.24(DB7/DouτA) U35.61(PB8)
ADC_FRSTDATA: U29.15(FRSTDATA) U35.54(PD2)
ADC_OS0: U29.3(OS0) U35.14(PA0-WKUP(PA0))
ADC_OS1: U29.4(OS1) U35.11(PC3)
ADC_OS2: U29.5(OS2) U35.10(PC2)
ADC_RANGE: U29.8(RANGE) U35.9(PC1)
ADC_RD: U29.12(RD#/SCLK) U35.51(PC10)
ADC_RESET: U29.11(RESET) U35.50(PA15(JTDI))
BOOT0: R18.1 SW6.3 U35.60(BOOT0)
DOWN: C135.2 R109.1 SW4.6(D) U35.41(PA8)
IPS_BL: R115.2 U35.22(PA6)
IPS_CS: FPC1.1 U35.20(PA4)
IPS_DC: FPC1.5 U35.24(PC4)
IPS_RESET: FPC1.6 U35.25(PC5)
IPS_SCL: FPC1.3 U35.21(PA5)
IPS_SDA: FPC1.4 U35.23(PA7)
LEFT: C134.1 R108.1 SW4.3(C) U35.39(PC8)
NRST: C34.2 R20.1 SW5.4 U35.7(NRST)
OSC_32_IN: C58.2 U35.3(PC14-OSC32_IN(PC14)) X2.1
OSC_32_OUT: C59.2 U35.4(PC15-OSC32_OUT(PC15)) X2.2
OSC_IN: C60.1 U35.5(PH0-OSC_IN(PH0)) X1.1
OSC_OUT: C61.2 U35.6(PH1-OSC_OUT(PH1)) X1.3
OTG_D+: U35.45(PA12) U37.2(IO) USB2.6(DP1) USB2.8(DP2)
OTG_D-: U35.44(PA11) U37.1(IO) USB2.5(DN2) USB2.7(DN1)
PRRESS: C136.2 R110.1 SW4.2(CEN) U35.38(PC7)
RIGHT: C133.1 R107.1 SW4.4(B) U35.40(PC9)
RXD: U20.4(TXD) U35.43(PA10)
SWCLK: U35.49(PA14(JTCK-SWCLK))
SWDIO: U35.46(PA13(JTMS-SWDIO))
TTL_D+: U20.7(UD+) U38.2(IO) USB3.6(DP1) USB3.8(DP2)
TTL_D-: U20.8(UD-) U38.1(IO) USB3.5(DN2) USB3.7(DN1)
TXD: U20.5(RXD) U35.42(PA9)
UP: C72.1 R106.1 SW4.1(A) U35.37(PC6)
USER: R104.2 U35.33(PB12)
$1N3863: R77.1 USB2.4(CC1)
$1N3864: R78.1 USB2.10(CC2)
$1N14437: C81.2 U35.31(VCAP_1)
$1N15249: R101.1 USB3.4(CC1)
$1N15250: R102.1 USB3.10(CC2)
$1N20405: LED6.6(-) R84.1
$1N20444: LED6.5(-) R103.1
$1N20483: LED6.4(-) R104.1
$1N20665: R79.2 SW4.5(COM)
$1N21331: R111.1 U35.28(PB2-BOOT1(PB2))
$1N23387: C137.1 U35.47(VCAP_2)
$1N27774: C65.2 USB2.14(SHELL) USB2.16(SHELL)
$1N27783: C169.2 USB2.13(SHELL) USB2.15(SHELL)
$1N27801: C108.2 USB3.14(SHELL) USB3.16(SHELL)
$1N27807: C170.2 USB3.13(SHELL) USB3.15(SHELL)
$1N29540: Q1.1(B) R115.1 R116.2
$1N29631: FPC1.8 Q1.3(C) R97.1
$2N5032: C104.1 U29.36(REGCAP)
$2N5113: C105.1 U29.39(REGCAP)
$2N5155: C106.1 U29.42(REFIN/REFOUT)
$2N5232: C107.1 U29.44(REFCAPA) U29.45(REFCAPB)

Not connected (* = marked no-connect by the designer): SW4 7(EH)*; U20 10(ACT#)* 11(DCD)* 12(DTRTNOW)* 13(RTS)* 14(DSR)* 15(CTS)* 16(RI)*; U29 7(STBY#)*; U35 15(PA1) 16(PA2)* 17(PA3)* 26(PB0)* 27(PB1)* 29(PB10)* 30(PB11)* 34(PB13)* 35(PB14)* 36(PB15)* 55(PB3(JTDOTRACESWO))* 56(PB4(NJTRST))* 57(PB5)* 58(PB6)* 59(PB7)*; U37 6(NC)* 7(NC)* 9(NC)* 10(NC)*; U38 4(IO)* 5(IO)* 6(NC)* 7(NC)* 9(NC)* 10(NC)*; U48 4(NC)*; USB2 3(SBU2)* 9(SBU1)*; USB3 2(VBUS)* 3(SBU2)* 9(SBU1)* 11(VBUS)*

## Notes on the sheets
sheet 1
- MCU
- BOOT & RESET
- CLOCK
- L_SPEED
- RESET
- H_SPEED
- BOOT
- FLASH
- USB_POWER
- H_SPEED
- L_SPEED
- USER
- USER_LED
- USB_TTL
- PULLUP
- FILTER
- DECOUPLE
- TVS_PROTECT
- USB_TTL
- LCD_114
sheet 2
- ADC
- INTERFACE
- DECOUPLE
sheet 3
- LDO_MCU
- 3V3
- AVCC
- FILTER
